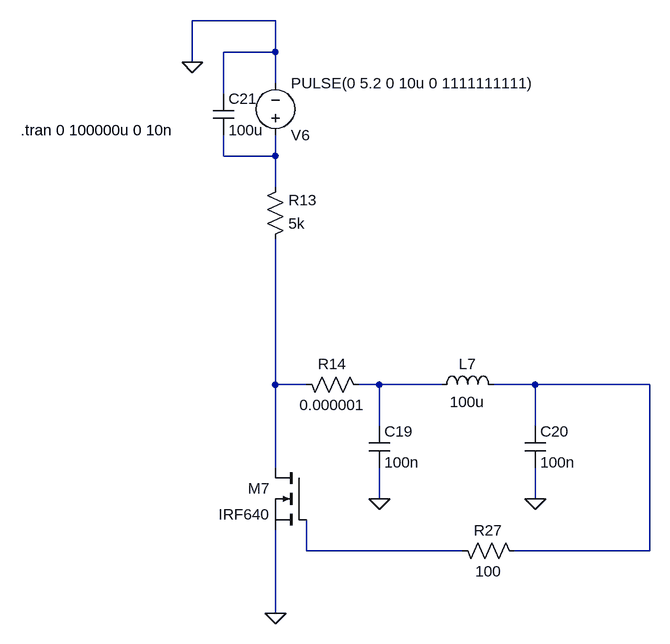
[diagram p0: schematic Colpits_IRF640_common_emitter_simple_scheme (2).asc]
Colpits_IRF640_common_emitter_simple_scheme (2).asc, the LTspice schematic file:
Version 4
SHEET 1 6468 2560
WIRE 3968 448 3840 448
WIRE 3968 496 3968 448
WIRE 3968 496 3888 496
WIRE 3840 512 3840 448
WIRE 3968 544 3968 496
WIRE 3888 560 3888 496
WIRE 3888 656 3888 624
WIRE 3968 656 3968 624
WIRE 3968 656 3888 656
WIRE 3968 704 3968 656
WIRE 3968 1008 3968 784
WIRE 4016 1008 3968 1008
WIRE 4128 1008 4096 1008
WIRE 4224 1008 4128 1008
WIRE 4368 1008 4304 1008
WIRE 4544 1008 4368 1008
WIRE 4128 1072 4128 1008
WIRE 4368 1072 4368 1008
WIRE 3968 1136 3968 1008
WIRE 4128 1184 4128 1136
WIRE 4368 1184 4368 1136
WIRE 4016 1264 4016 1216
WIRE 4256 1264 4016 1264
WIRE 4544 1264 4544 1008
WIRE 4544 1264 4336 1264
WIRE 3968 1360 3968 1232
FLAG 4128 1184 0
FLAG 4368 1184 0
FLAG 3968 1360 0
FLAG 3840 512 0
SYMBOL voltage 3968 640 M180
WINDOW 123 0 0 Left 0
WINDOW 39 0 0 Left 0
SYMATTR InstName V6
SYMATTR Value PULSE(0 5.2 0 10u 0 1111111111)
SYMBOL res 3952 800 M180
WINDOW 0 36 76 Left 2
WINDOW 3 36 40 Left 2
SYMATTR InstName R13
SYMATTR Value 5k
SYMBOL cap 4112 1136 M180
WINDOW 0 24 56 Left 2
WINDOW 3 24 8 Left 2
SYMATTR InstName C19
SYMATTR Value 100n
SYMBOL cap 4352 1136 M180
WINDOW 0 24 56 Left 2
WINDOW 3 24 8 Left 2
SYMATTR InstName C20
SYMATTR Value 100n
SYMBOL ind 4320 1024 M270
WINDOW 0 32 56 VTop 2
WINDOW 3 5 56 VBottom 2
SYMATTR InstName L7
SYMATTR Value 100u
SYMBOL nmos 4016 1136 M0
SYMATTR InstName M7
SYMATTR Value IRF640
SYMBOL cap 3872 624 M180
WINDOW 0 24 56 Left 2
WINDOW 3 24 8 Left 2
SYMATTR InstName C21
SYMATTR Value 100u
SYMBOL res 4000 992 M90
WINDOW 0 0 56 VBottom 2
WINDOW 3 32 56 VTop 2
SYMATTR InstName R14
SYMATTR Value 0.000001
SYMBOL res 4240 1248 M90
WINDOW 0 0 56 VBottom 2
WINDOW 3 32 56 VTop 2
SYMATTR InstName R27
SYMATTR Value 100
TEXT 3576 616 Left 2 !.tran 0 100000u 0 10n

The netlist it stands for:
* Colpits_IRF640_common_emitter_simple_scheme (2).asc
V6 N001 0 PULSE(0 5.2 0 10u 0 1111111111)
R13 N002 N001 5k
C19 0 N003 100n
C20 0 N004 100n
L7 N004 N003 100u
M7 N002 N005 0 0 IRF640
C21 N001 0 100u
R14 N002 N003 0.000001
R27 N005 N004 100
.model NMOS NMOS
.model PMOS PMOS
.lib standard.mos
.tran 0 100000u 0 10n
.backanno
.end